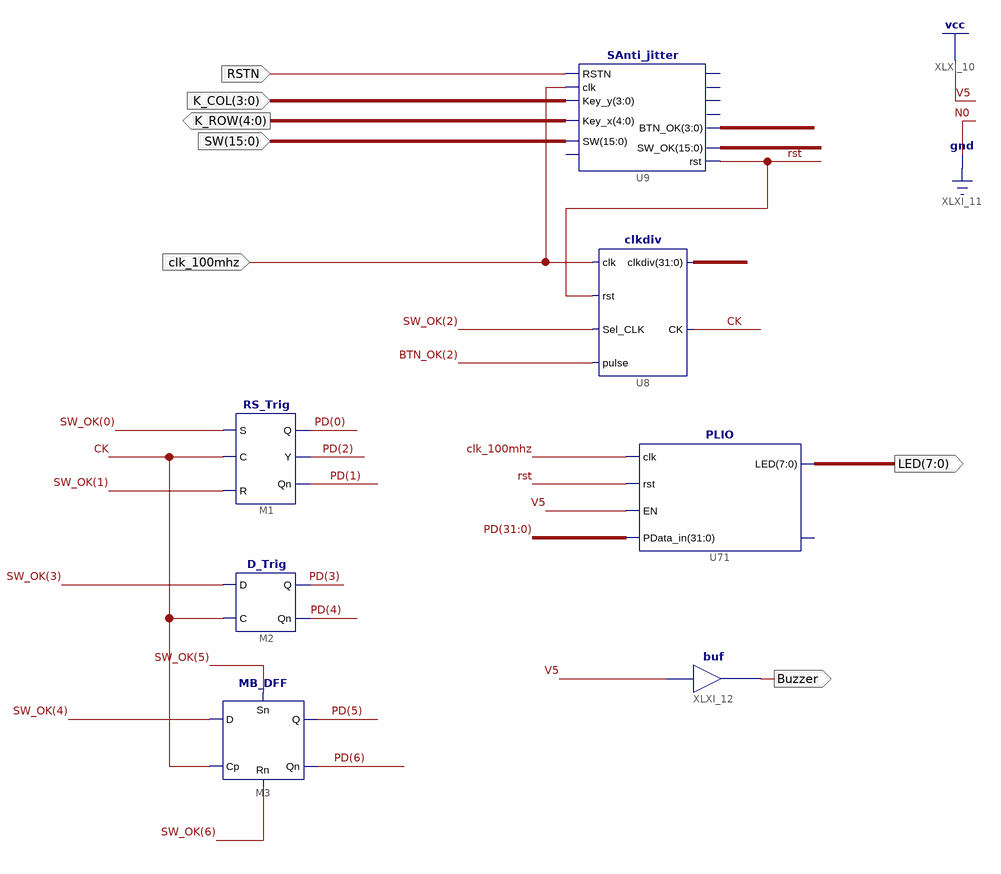
[diagram p0: schematic sheet 1]
// Xilinx ISE schematic Trigger_Top.sch (kintex7) as structural Verilog: 7 symbols, 7 ports
module Trigger_Top (
  input  RSTN,
  input  clk_100mhz,
  input  [3:0] K_COL,
  input  [15:0] SW,
  output [4:0] K_ROW,
  output Buzzer,
  output [7:0] LED
);

  wire CK, rst;
  wire [3:0] BTN_OK;
  wire [15:0] SW_OK;
  wire [31:0] Div, PD;

  SAnti_jitter U9 (
    .SW(SW), .Key_y(K_COL), .Key_x(K_ROW), .RSTN(RSTN), .clk(clk_100mhz), .rst(rst), .SW_OK(SW_OK),
    .BTN_OK(BTN_OK));  // open: readn, Key_out, Key_ready, CR, pulse_out
  clkdiv U8 (.clk(clk_100mhz), .rst(rst), .Sel_CLK(SW_OK[2]), .CK(CK), .clkdiv(Div), .pulse(BTN_OK[2]));
  RS_Trig M1 (.C(CK), .S(SW_OK[0]), .R(SW_OK[1]), .Y(PD[2]), .Q(PD[0]), .Qn(PD[1]));
  D_Trig M2 (.C(CK), .D(SW_OK[3]), .Q(PD[3]), .Qn(PD[4]));
  MB_DFF M3 (.Sn(SW_OK[5]), .Rn(SW_OK[6]), .D(SW_OK[4]), .Cp(CK), .Q(PD[5]), .Qn(PD[6]));
  buf XLXI_12 (Buzzer, 1'b1);
  PLIO U71 (.clk(clk_100mhz), .rst(rst), .EN(1'b1), .PData_in(PD), .LED(LED));  // open: GPIOf0
endmodule
